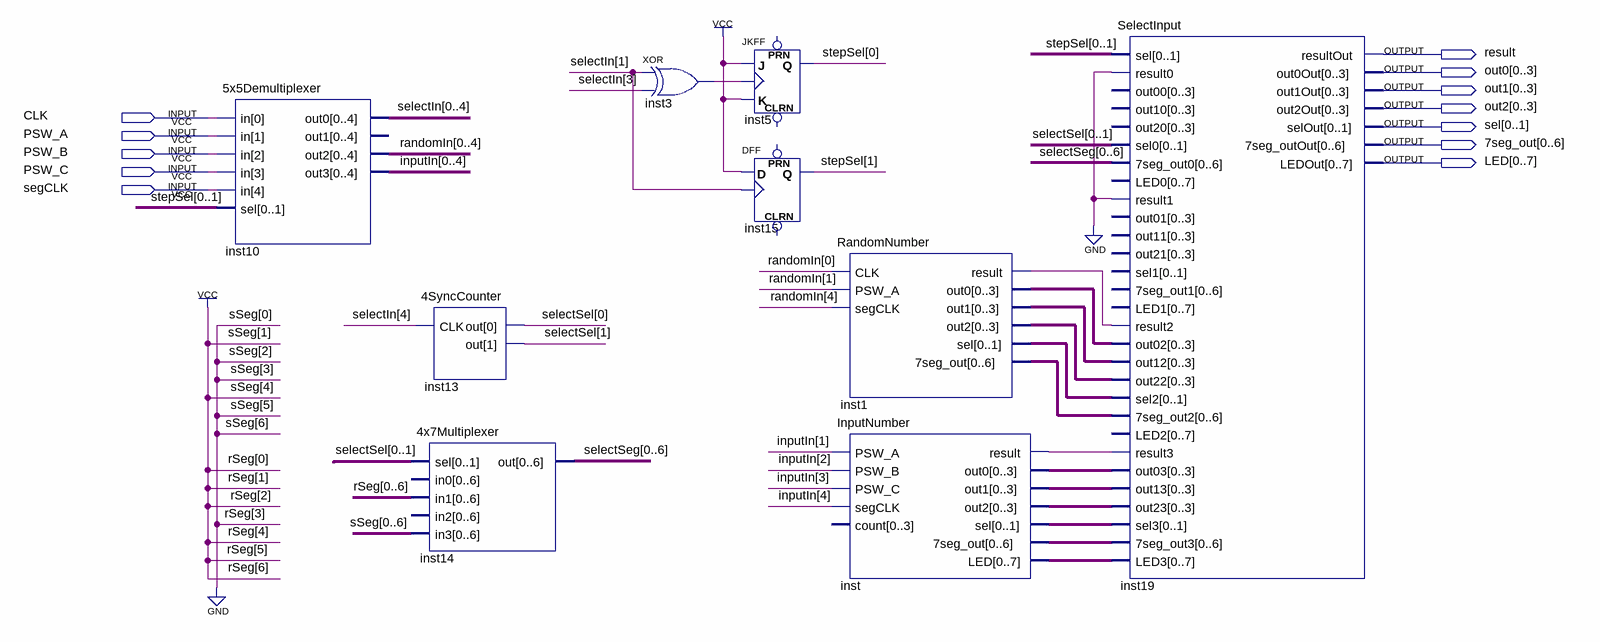
[diagram p0: schematic sheet]
// Quartus schematic GenerateNumber.bdf as structural Verilog: 9 symbols, 12 pins
module GenerateNumber (
  input  CLK,
  input  PSW_A,
  input  PSW_B,
  input  PSW_C,
  input  segCLK,
  output result,
  output [0:3] out0,
  output [0:3] out1,
  output [0:3] out2,
  output [0:1] sel,
  output [0:6] \7seg_out ,
  output [0:7] LED
);

  wire inst1_result, inst3_out, inst_result;
  wire [1:0] inst1_sel, inst_sel, selectSel, stepSel;
  wire [3:0] inst1_out0, inst1_out1, inst1_out2, inst_out0, inst_out1, inst_out2;
  wire [4:0] inputIn, randomIn, selectIn;
  wire [6:0] inst1_7seg_out, inst_7seg_out, selectSeg;
  wire [7:0] inst_led;

  \5x5Demultiplexer  inst10 (
    .in({segCLK, PSW_C, PSW_B, PSW_A, CLK}), .sel({stepSel[0], stepSel[1]}),
    .out0({selectIn[0], selectIn[1], selectIn[2], selectIn[3], selectIn[4]}),
    .out2({randomIn[0], randomIn[1], randomIn[2], randomIn[3], randomIn[4]}),
    .out3({inputIn[0], inputIn[1], inputIn[2], inputIn[3], inputIn[4]}));  // open: out1
  \4SyncCounter  inst13 (.CLK(selectIn[4]), .out(selectSel));
  \4x7Multiplexer  inst14 (
    .sel({selectSel[0], selectSel[1]}), .in1(7'b1110111), .in3(7'b0100100),
    .out({selectSeg[0], selectSeg[1], selectSeg[2], selectSeg[3], selectSeg[4], selectSeg[5], selectSeg[6]}));  // open: in0, in2
  xor inst3 (inst3_out, selectIn[1], selectIn[3]);
  JKFF inst5 (.K(1'b1), .J(1'b1), .CLK(inst3_out), .Q(stepSel[0]));  // open: PRN, CLRN
  DFF inst15 (.CLK(selectIn[1]), .D(1'b1), .Q(stepSel[1]));  // open: CLRN, PRN
  RandomNumber inst1 (
    .CLK(randomIn[0]), .PSW_A(randomIn[1]), .segCLK(randomIn[4]), .result(inst1_result), .out0(inst1_out0),
    .out1(inst1_out1), .out2(inst1_out2), .sel(inst1_sel), .\7seg_out (inst1_7seg_out));
  InputNumber inst (
    .PSW_A(inputIn[1]), .PSW_B(inputIn[2]), .PSW_C(inputIn[3]), .segCLK(inputIn[4]), .result(inst_result),
    .out0(inst_out0), .out1(inst_out1), .out2(inst_out2), .sel(inst_sel), .\7seg_out (inst_7seg_out),
    .LED(inst_led));  // open: count
  SelectInput inst19 (
    .sel({stepSel[0], stepSel[1]}), .result0(1'b0), .sel0({selectSel[0], selectSel[1]}),
    .\7seg_out0 ({selectSeg[0], selectSeg[1], selectSeg[2], selectSeg[3], selectSeg[4], selectSeg[5], selectSeg[6]}),
    .result1(1'b0), .result2(inst1_result), .out02(inst1_out0), .out12(inst1_out1), .out22(inst1_out2),
    .sel2(inst1_sel), .\7seg_out2 (inst1_7seg_out), .result3(inst_result), .out03(inst_out0),
    .out13(inst_out1), .out23(inst_out2), .sel3(inst_sel), .\7seg_out3 (inst_7seg_out), .LED3(inst_led),
    .resultOut(result), .out0Out(out0), .out1Out(out1), .out2Out(out2), .selOut(sel),
    .\7seg_outOut (\7seg_out ), .LEDOut(LED));  // open: out00, out10, out20, LED0, out01, out11, out21, sel1, 7seg_out1, LED1, LED2
endmodule
